# EAGLE schematic Aux Power Board V1.1 (EAGLE 9.2.2)

## Sheet 1 of 3
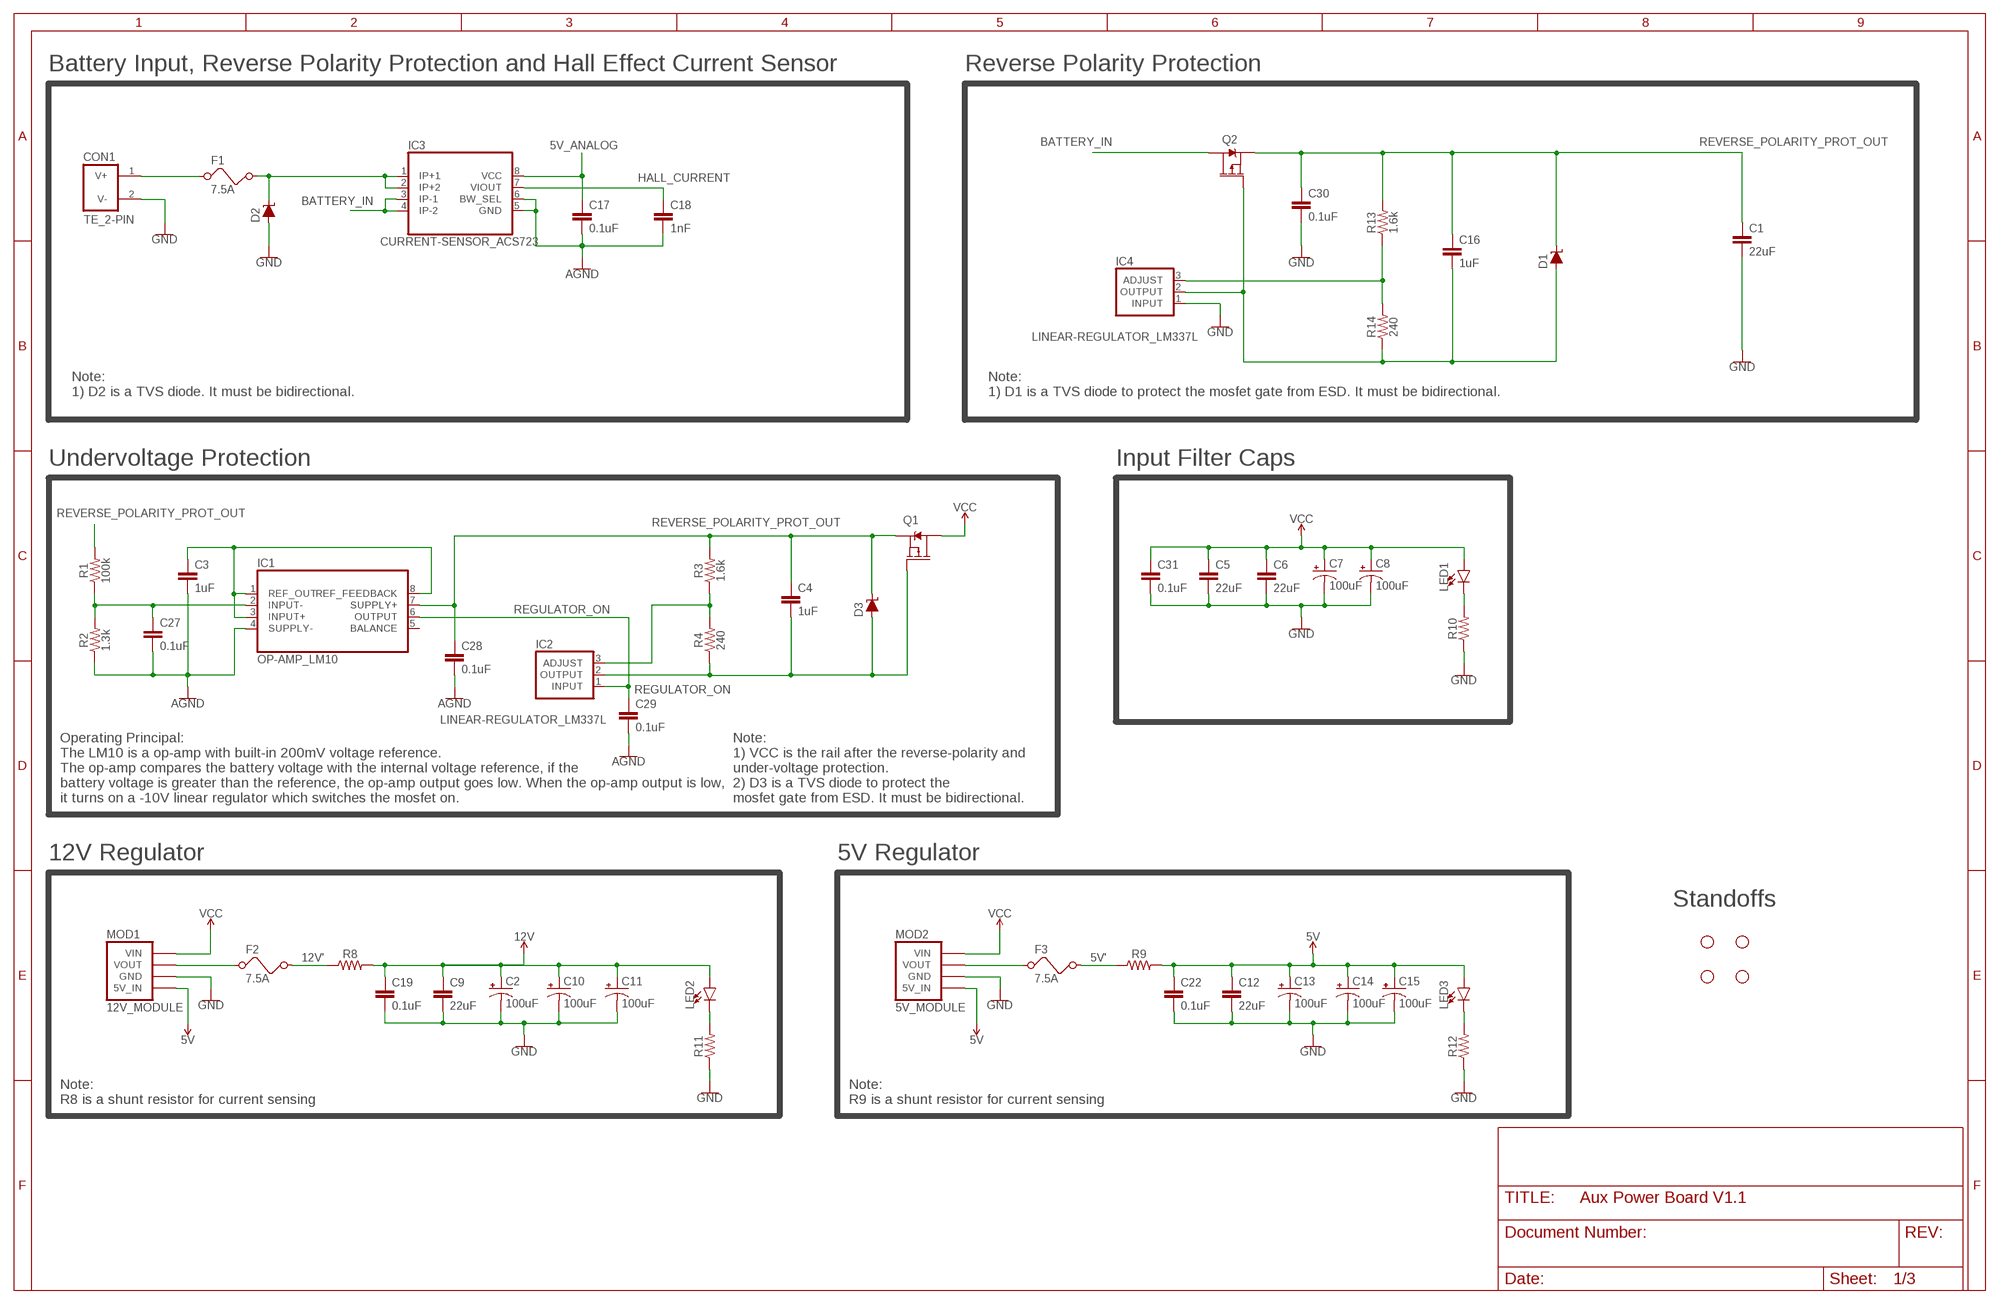
[diagram p0: schematic, sheet 1]

### Parts
C1  22uF  CAPACITOR_1210  [1210]
C2  100uF  CAPACITOR_ELECTROLYTIC_100UF  [CAPACITOR_100UF_50V]
C3  1uF  CAPACITOR_0805  [0805]
C4  1uF  CAPACITOR_0805  [0805]
C5  22uF  CAPACITOR_1210  [1210]
C6  22uF  CAPACITOR_1210  [1210]
C7  100uF  CAPACITOR_ELECTROLYTIC_100UF  [CAPACITOR_100UF_50V]
C8  100uF  CAPACITOR_ELECTROLYTIC_100UF  [CAPACITOR_100UF_50V]
C9  22uF  CAPACITOR_0805  [0805]
C10  100uF  CAPACITOR_ELECTROLYTIC_100UF  [CAPACITOR_100UF_50V]
C11  100uF  CAPACITOR_ELECTROLYTIC_100UF  [CAPACITOR_100UF_50V]
C12  22uF  CAPACITOR_0805  [0805]
C13  100uF  CAPACITOR_ELECTROLYTIC_100UF  [CAPACITOR_100UF_50V]
C14  100uF  CAPACITOR_ELECTROLYTIC_100UF  [CAPACITOR_100UF_50V]
C15  100uF  CAPACITOR_ELECTROLYTIC_100UF  [CAPACITOR_100UF_50V]
C16  1uF  CAPACITOR_0805  [0805]
C17  0.1uF  CAPACITOR_0805  [0805]
C18  1nF  CAPACITOR_0805  [0805]
C19  0.1uF  CAPACITOR_0805  [0805]
C22  0.1uF  CAPACITOR_0805  [0805]
C27  0.1uF  CAPACITOR_0805  [0805]
C28  0.1uF  CAPACITOR_0805  [0805]
C29  0.1uF  CAPACITOR_0805  [0805]
C30  0.1uF  CAPACITOR_0805  [0805]
C31  0.1uF  CAPACITOR_0805  [0805]
CON1  TE_2-PIN  [TE_2-PIN]
D1  DIODE_TVS_DO-214AA  [DO214AA]
D2  DIODE_TVS_DO-214AA  [DO214AA]
D3  DIODE_TVS_DO-214AA  [DO214AA]
F1  7.5A  FUSEHOLDER_VERTICAL  [FUSEHOLDER_VERTICAL]
F2  7.5A  FUSEHOLDER_VERTICAL  [FUSEHOLDER_VERTICAL]
F3  7.5A  FUSEHOLDER_VERTICAL  [FUSEHOLDER_VERTICAL]
H1  STAND-OFF  [STAND-OFF]
H2  STAND-OFF  [STAND-OFF]
H3  STAND-OFF  [STAND-OFF]
H4  STAND-OFF  [STAND-OFF]
IC1  OP-AMP_LM10  [DIP08]
IC2  LINEAR-REGULATOR_LM337L  [TO92]
IC3  CURRENT-SENSOR_ACS723  [SOIC8]
IC4  LINEAR-REGULATOR_LM337L  [TO92]
LED1  LED_0805  [0805_LED]
LED2  LED_0805  [0805_LED]
LED3  LED_0805  [0805_LED]
MOD1  12V_MODULE  [5/12V_MODULE]
MOD2  5V_MODULE  [5/12V_MODULE]
Q1  MOSFET_PMOS_TO-263  [TO-263/D2PAK]
Q2  MOSFET_PMOS_TO-263  [TO-263/D2PAK]
R1  100k  RESISTOR_0805  [0805]
R2  1.3k  RESISTOR_0805  [0805]
R3  1.6k  RESISTOR_0805  [0805]
R4  240  RESISTOR_0805  [0805]
R8  RESISTOR_1210  [1210]
R9  RESISTOR_1210  [1210]
R10  RESISTOR_0805  [0805]
R11  RESISTOR_0805  [0805]
R12  RESISTOR_0805  [0805]
R13  1.6k  RESISTOR_0805  [0805]
R14  240  RESISTOR_0805  [0805]

### Nets
5V: C12.1 C13.+ C14.+ C15.+ C22.1 LED3.1(A) MOD1.P$32(5V_IN) MOD2.P$32(5V_IN) R9.2 ; also sheet 2,3
5V': F3.3 F3.4 R9.1 ; also sheet 3
5V_ANALOG: C17.1 IC3.8(VCC) ; also sheet 3
12V: C2.+ C9.1 C10.+ C11.+ C19.1 LED2.1(A) R8.2 ; also sheet 2,3
12V': F2.3 F2.4 R8.1 ; also sheet 3
AGND: C3.2 C17.2 C18.2 C27.2 C28.2 C29.2 IC1.4(SUPPLY-) IC3.5(GND) IC3.6(BW_SEL) R2.1 ; also sheet 3
BATTERY_IN: IC3.3(IP-1) IC3.4(IP-2) Q2.2(D) ; also sheet 3
GND: C1.2 C2.- C5.2 C6.2 C7.- C8.- C9.2 C10.- C11.- C12.2 C13.- C14.- C15.- C19.2 C22.2 C30.2 C31.2 CON1.2(V-) D2.A IC4.1(INPUT) MOD1.P$25(GND) MOD1.P$26(GND) MOD1.P$27(GND) MOD1.P$28(GND) MOD1.P$29(GND) MOD1.P$30(GND) MOD1.P$31(GND) MOD2.P$25(GND) MOD2.P$26(GND) MOD2.P$27(GND) MOD2.P$28(GND) MOD2.P$29(GND) MOD2.P$30(GND) MOD2.P$31(GND) R10.1 R11.1 R12.1 ; also sheet 2,3
HALL_CURRENT: C18.1 IC3.7(VIOUT) ; also sheet 3
N$2: CON1.1(V+) F1.1 F1.2
N$4: LED1.2(C) R10.2
N$5: C3.1 IC1.1(REF_OUT) IC1.3(INPUT+) IC1.8(REF_FEEDBACK)
N$6: C27.1 IC1.2(INPUT-) R1.1 R2.2
N$7: F2.1 F2.2 MOD1.P$9(VOUT) MOD1.P$10(VOUT) MOD1.P$11(VOUT) MOD1.P$12(VOUT) MOD1.P$13(VOUT) MOD1.P$14(VOUT) MOD1.P$15(VOUT) MOD1.P$16(VOUT) MOD1.P$17(VOUT) MOD1.P$18(VOUT) MOD1.P$19(VOUT) MOD1.P$20(VOUT) MOD1.P$21(VOUT) MOD1.P$22(VOUT) MOD1.P$23(VOUT) MOD1.P$24(VOUT)
N$8: C4.2 D3.A IC2.2(OUTPUT) Q1.1(G) R4.1
N$9: IC2.3(ADJUST) R3.1 R4.2
N$11: F3.1 F3.2 MOD2.P$9(VOUT) MOD2.P$10(VOUT) MOD2.P$11(VOUT) MOD2.P$12(VOUT) MOD2.P$13(VOUT) MOD2.P$14(VOUT) MOD2.P$15(VOUT) MOD2.P$16(VOUT) MOD2.P$17(VOUT) MOD2.P$18(VOUT) MOD2.P$19(VOUT) MOD2.P$20(VOUT) MOD2.P$21(VOUT) MOD2.P$22(VOUT) MOD2.P$23(VOUT) MOD2.P$24(VOUT)
N$13: LED3.2(C) R12.2
N$17: LED2.2(C) R11.2
N$18: IC4.3(ADJUST) R13.1 R14.2
N$21: C16.2 D1.A IC4.2(OUTPUT) Q2.1(G) R14.1
N$22: D2.C F1.3 F1.4 IC3.1(IP+1) IC3.2(IP+2)
REGULATOR_ON: C29.1 IC1.6(OUTPUT) IC2.1(INPUT)
REVERSE_POLARITY_PROT_OUT: C1.1 C4.1 C16.1 C28.1 C30.1 D1.C D3.C IC1.7(SUPPLY+) Q1.3(S) Q2.3(S) R1.2 R3.2 R13.2
VCC: C5.1 C6.1 C7.+ C8.+ C31.1 LED1.1(A) MOD1.P$1(VIN) MOD1.P$2(VIN) MOD1.P$3(VIN) MOD1.P$4(VIN) MOD1.P$5(VIN) MOD1.P$6(VIN) MOD1.P$7(VIN) MOD1.P$8(VIN) MOD2.P$1(VIN) MOD2.P$2(VIN) MOD2.P$3(VIN) MOD2.P$4(VIN) MOD2.P$5(VIN) MOD2.P$6(VIN) MOD2.P$7(VIN) MOD2.P$8(VIN) Q1.2(D) ; also sheet 3
Unconnected: IC1.5(BALANCE)

### Notes on the sheet
- Battery Input, Reverse Polarity Protection and Hall Effect Current Sensor | Reverse Polarity Protection
- Note: 
  1) D2 is a TVS diode. It must be bidirectional.
- Note: 
  1) D1 is a TVS diode to protect the mosfet gate from ESD. It must be bidirectional.
- Undervoltage Protection | Input Filter Caps
- Operating Principal: 
  The LM10 is a op-amp with built-in 200mV voltage reference.
  The op-amp compares the battery voltage with the internal voltage reference, if the 
  battery voltage is greater than the reference, the op-amp output goes low. When the op-amp output is low, 
  it turns on a -10V linear regulator which switches the mosfet on.
- Note: 
  1) VCC is the rail after the reverse-polarity and
  under-voltage protection.
  2) D3 is a TVS diode to protect the
  mosfet gate from ESD. It must be bidirectional.
- 12V Regulator | 5V Regulator
- Standoffs
- Note: 
  R8 is a shunt resistor for current sensing
- Note: 
  R9 is a shunt resistor for current sensing

## Sheet 2 of 3
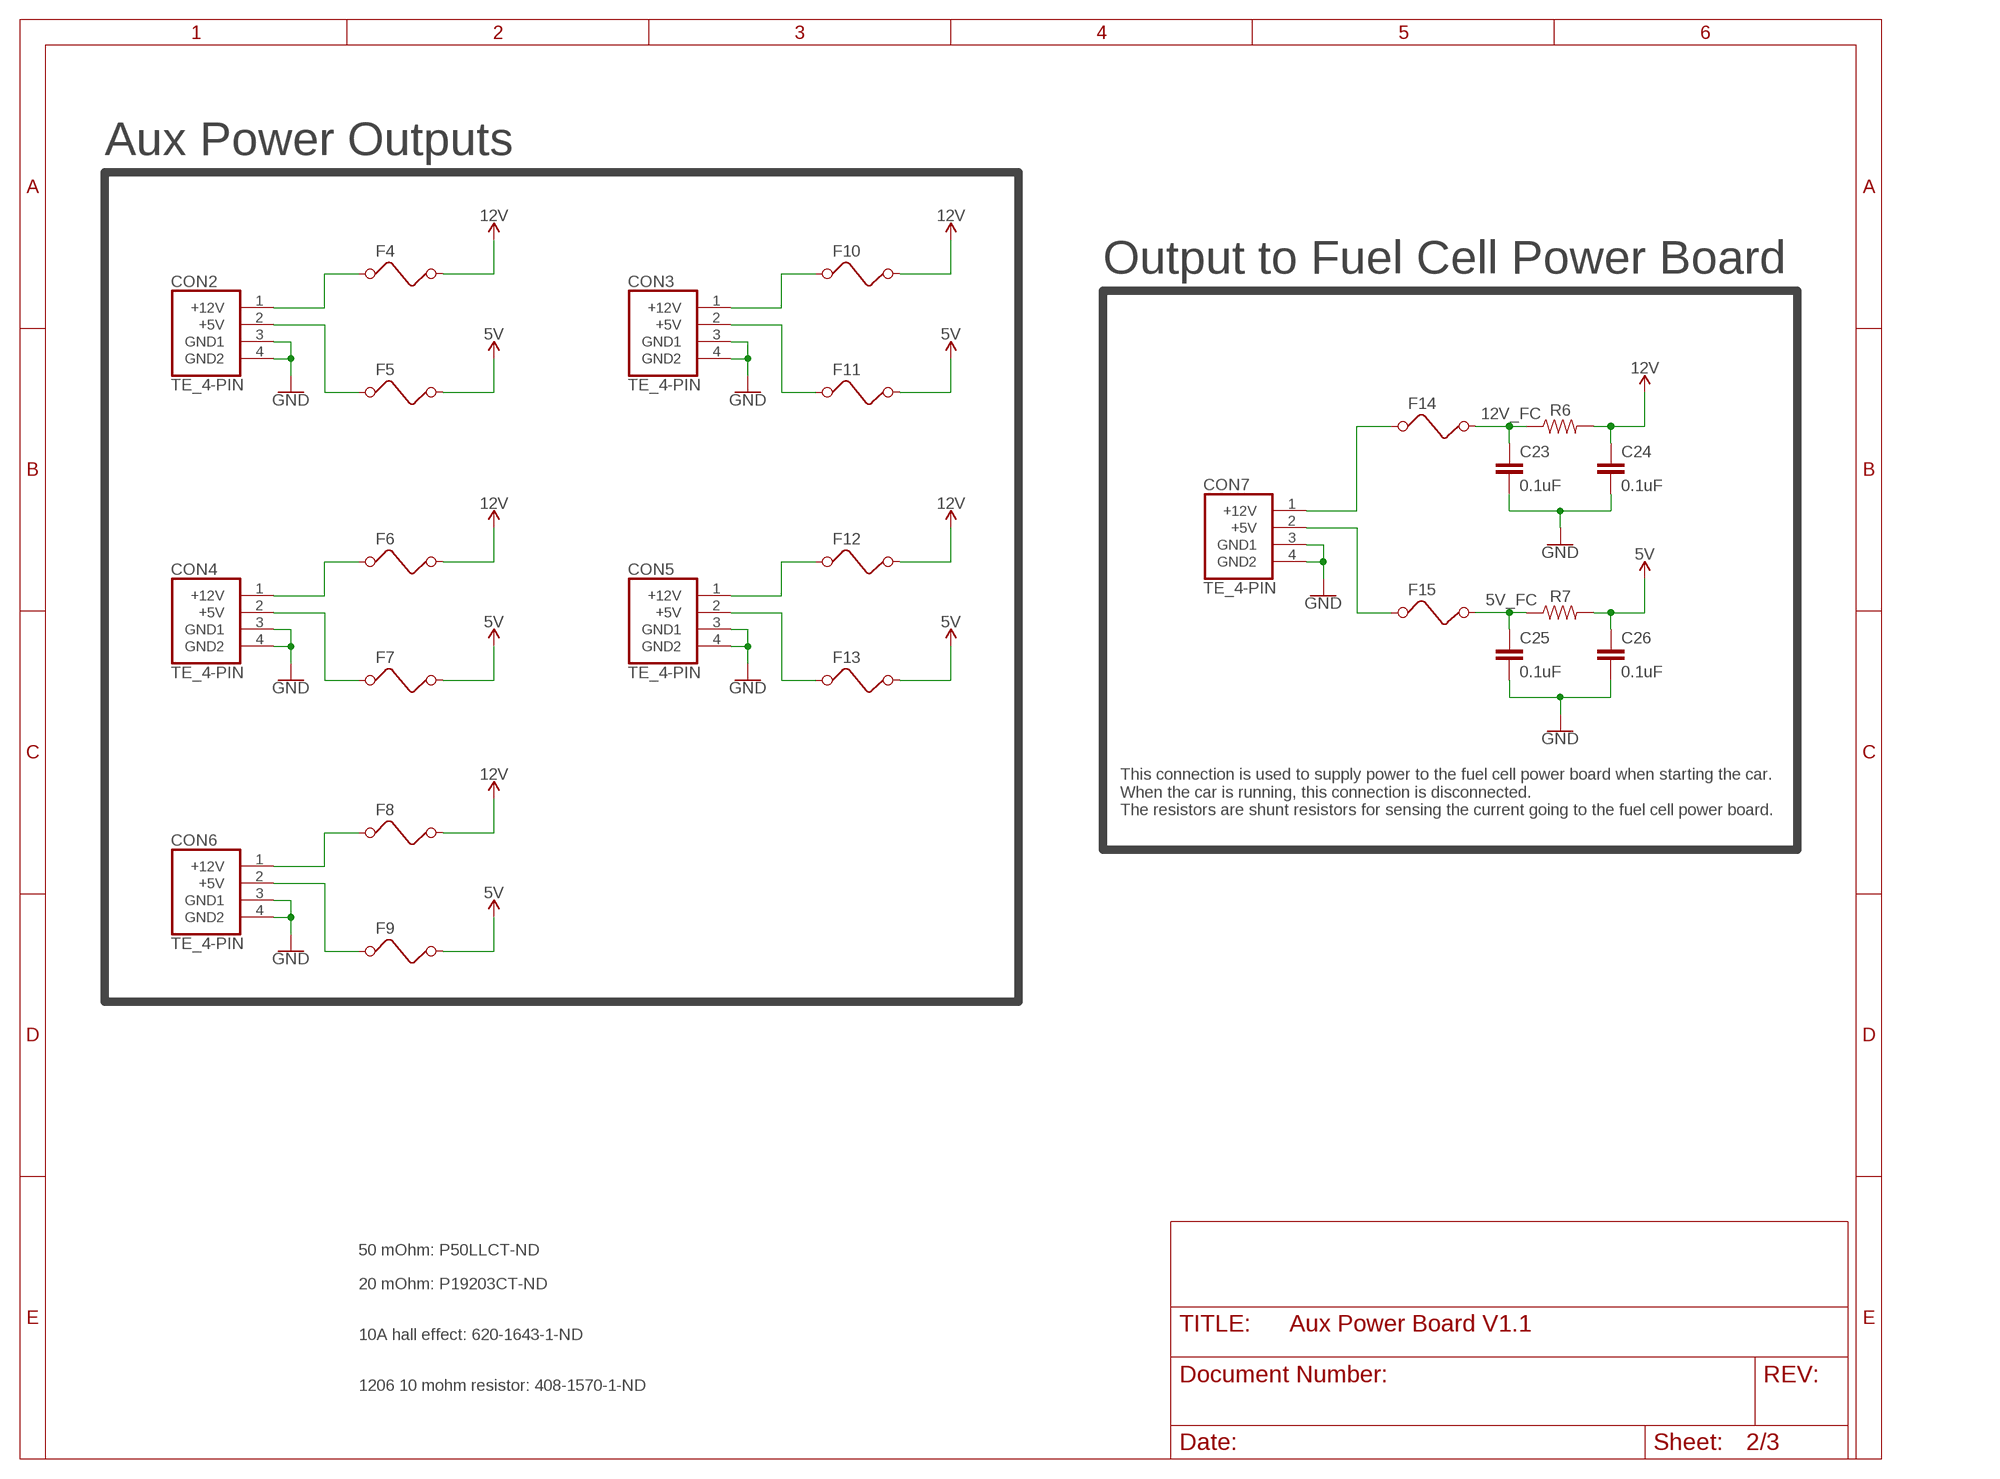
[diagram p1: schematic, sheet 2]

### Parts
C23  0.1uF  CAPACITOR_0805  [0805]
C24  0.1uF  CAPACITOR_0805  [0805]
C25  0.1uF  CAPACITOR_0805  [0805]
C26  0.1uF  CAPACITOR_0805  [0805]
CON2  TE_4-PIN  [TE_4-PIN]
CON3  TE_4-PIN  [TE_4-PIN]
CON4  TE_4-PIN  [TE_4-PIN]
CON5  TE_4-PIN  [TE_4-PIN]
CON6  TE_4-PIN  [TE_4-PIN]
CON7  TE_4-PIN  [TE_4-PIN]
F4  FUSE_1210  [1210]
F5  FUSE_1210  [1210]
F6  FUSE_1210  [1210]
F7  FUSE_1210  [1210]
F8  FUSE_1210  [1210]
F9  FUSE_1210  [1210]
F10  FUSE_1210  [1210]
F11  FUSE_1210  [1210]
F12  FUSE_1210  [1210]
F13  FUSE_1210  [1210]
F14  FUSE_1210  [1210]
F15  FUSE_1210  [1210]
R6  RESISTOR_1210  [1210]
R7  RESISTOR_1210  [1210]

### Nets
5V: C26.1 F5.2 F7.2 F9.2 F11.2 F13.2 R7.2 ; also sheet 1,3
5V_FC: C25.1 F15.2 R7.1 ; also sheet 3
12V: C24.1 F4.2 F6.2 F8.2 F10.2 F12.2 R6.2 ; also sheet 1,3
12V_FC: C23.1 F14.2 R6.1 ; also sheet 3
GND: C23.2 C24.2 C25.2 C26.2 CON2.3(GND1) CON2.4(GND2) CON3.3(GND1) CON3.4(GND2) CON4.3(GND1) CON4.4(GND2) CON5.3(GND1) CON5.4(GND2) CON6.3(GND1) CON6.4(GND2) CON7.3(GND1) CON7.4(GND2) ; also sheet 1,3
N$1: CON2.1(+12V) F4.1
N$10: CON2.2(+5V) F5.1
N$15: CON3.2(+5V) F11.1
N$16: CON3.1(+12V) F10.1
N$19: CON5.2(+5V) F13.1
N$20: CON5.1(+12V) F12.1
N$23: CON4.2(+5V) F7.1
N$24: CON4.1(+12V) F6.1
N$27: CON6.2(+5V) F9.1
N$28: CON6.1(+12V) F8.1
N$31: CON7.2(+5V) F15.1
N$32: CON7.1(+12V) F14.1

### Notes on the sheet
- Aux Power Outputs
- Output to Fuel Cell Power Board
- This connection is used to supply power to the fuel cell power board when starting the car. 
  When the car is running, this connection is disconnected.
  The resistors are shunt resistors for sensing the current going to the fuel cell power board.
- 50 mOhm: P50LLCT-ND
- 20 mOhm: P19203CT-ND
- 10A hall effect: 620-1643-1-ND
- 1206 10 mohm resistor: 408-1570-1-ND

## Sheet 3 of 3
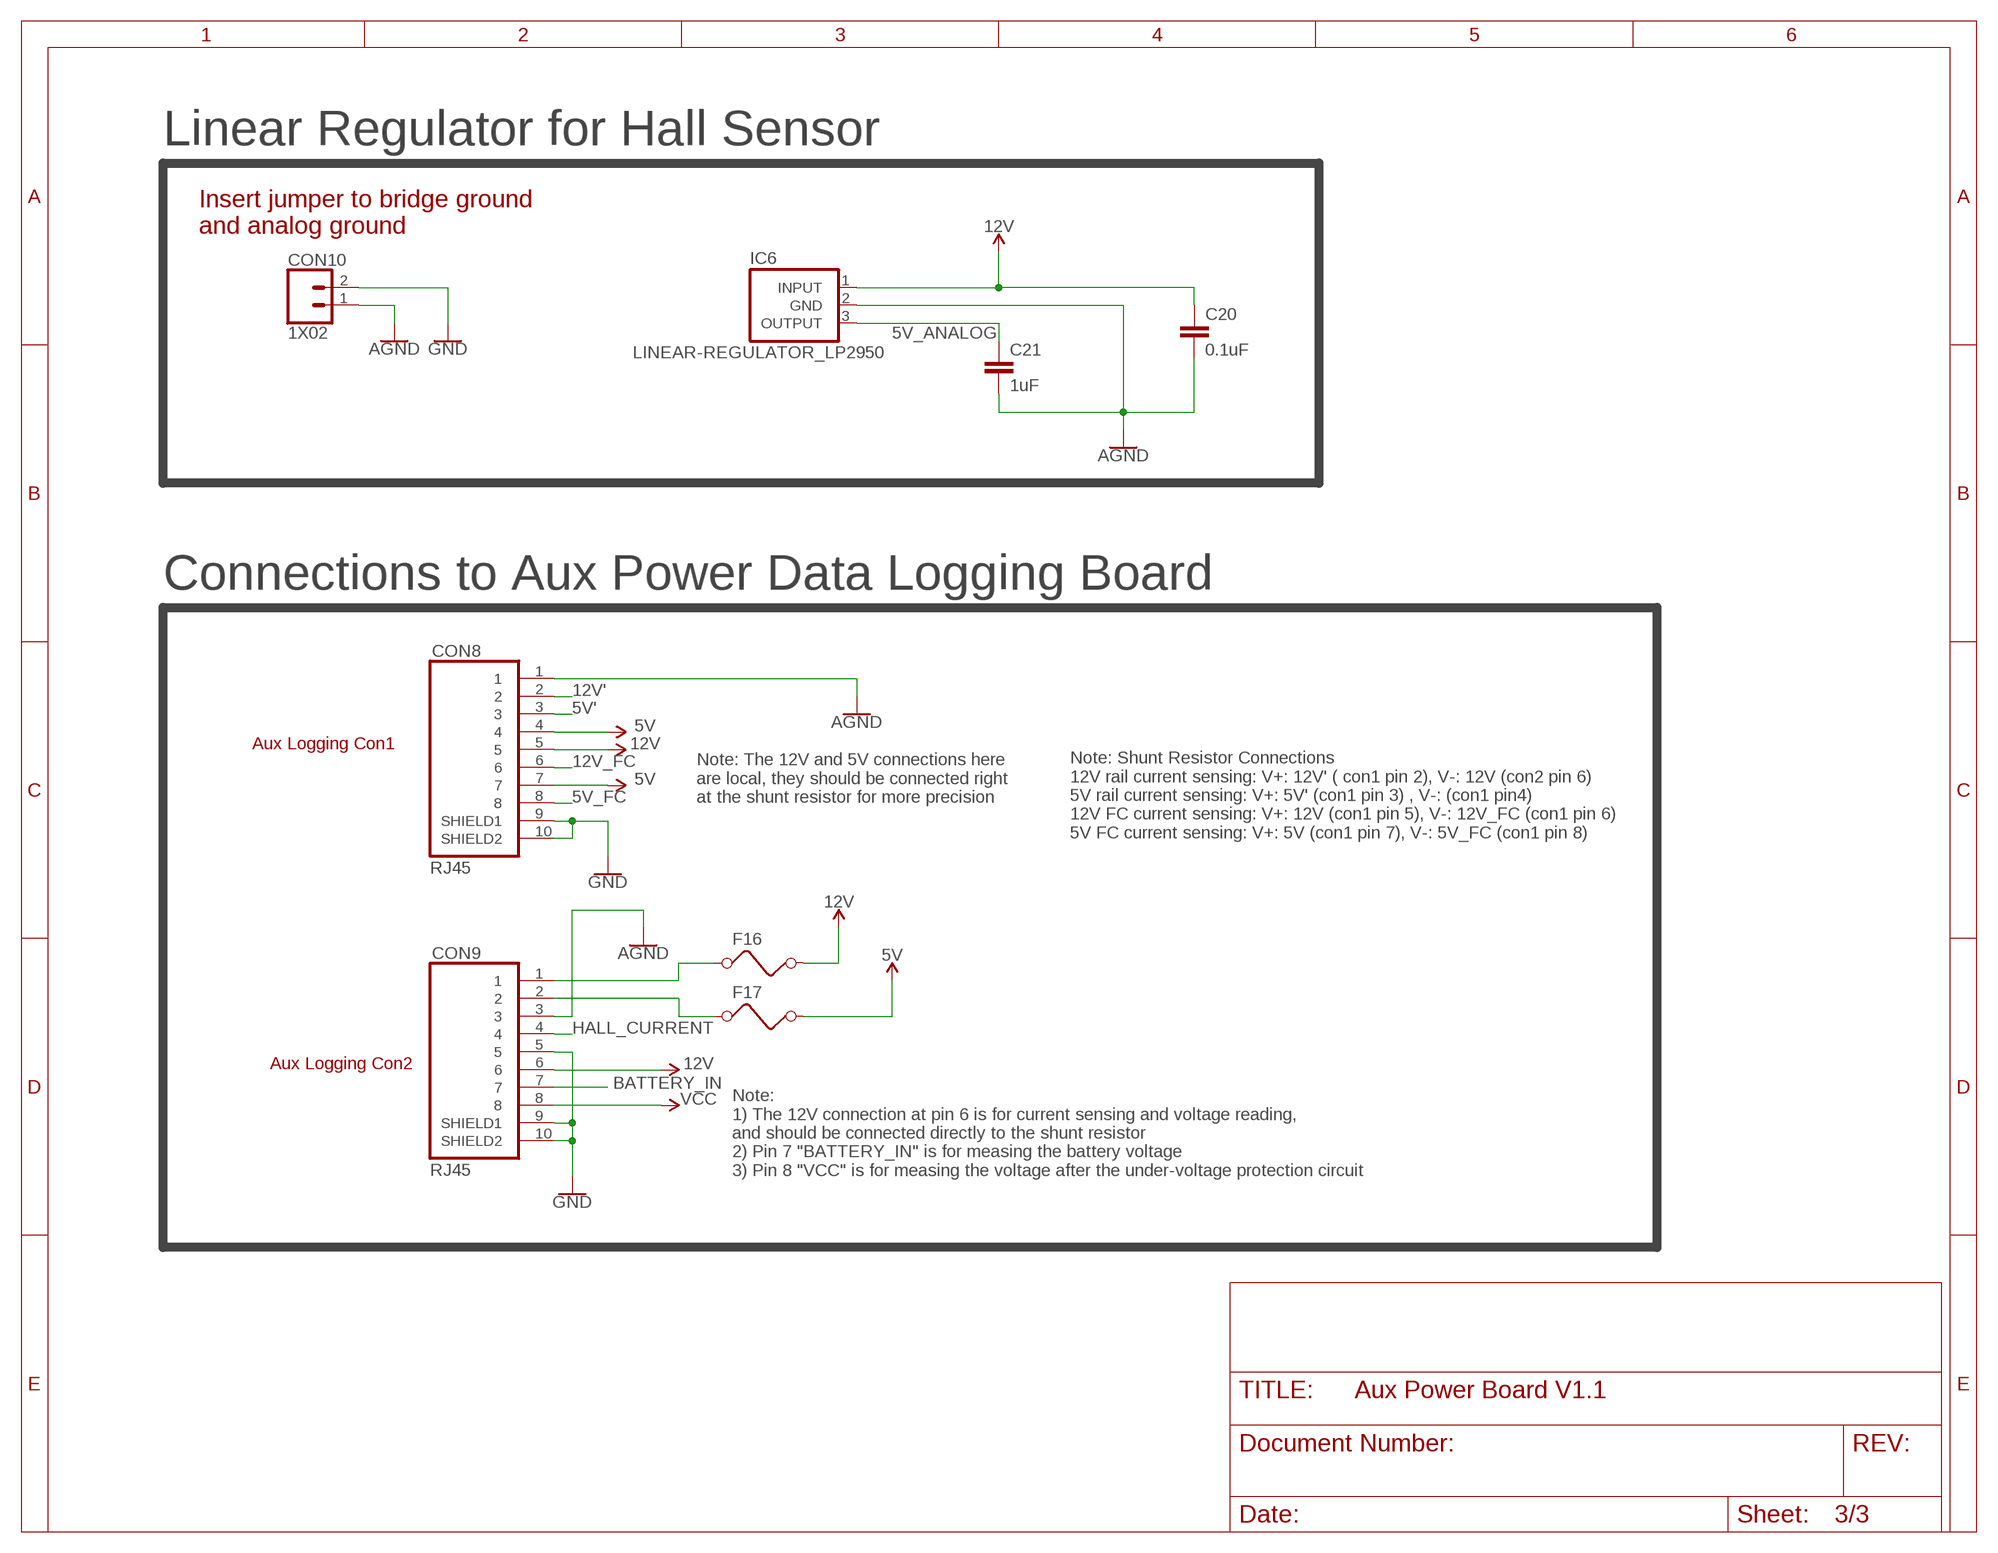
[diagram p2: schematic, sheet 3]

### Parts
C20  0.1uF  CAPACITOR_0805  [0805]
C21  1uF  CAPACITOR_0805  [0805]
CON8  RJ45  [RJ45]
CON9  RJ45  [RJ45]
CON10  1X02  [1X02]
F16  FUSE_1210  [1210]
F17  FUSE_1210  [1210]
IC6  LINEAR-REGULATOR_LP2950  [TO92]

### Nets
5V: CON8.4 CON8.7 F17.2 ; also sheet 1,2
5V': CON8.3 ; also sheet 1
5V_ANALOG: C21.1 IC6.3(OUTPUT) ; also sheet 1
5V_FC: CON8.8 ; also sheet 2
12V: C20.1 CON8.5 CON9.6 F16.2 IC6.1(INPUT) ; also sheet 1,2
12V': CON8.2 ; also sheet 1
12V_FC: CON8.6 ; also sheet 2
AGND: C20.2 C21.2 CON8.1 CON9.3 CON10.1 IC6.2(GND) ; also sheet 1
BATTERY_IN: CON9.7 ; also sheet 1
GND: CON8.9(SHIELD1) CON8.10(SHIELD2) CON9.5 CON9.9(SHIELD1) CON9.10(SHIELD2) CON10.2 ; also sheet 1,2
HALL_CURRENT: CON9.4 ; also sheet 1
N$12: CON9.1 F16.1
N$14: CON9.2 F17.1
VCC: CON9.8 ; also sheet 1

### Notes on the sheet
- Linear Regulator for Hall Sensor
- Insert jumper to bridge ground
  and analog ground
- Connections to Aux Power Data Logging Board
- Aux Logging Con1
- Note: The 12V and 5V connections here
  are local, they should be connected right
  at the shunt resistor for more precision
- Note: Shunt Resistor Connections
  12V rail current sensing: V+: 12V' ( con1 pin 2), V-: 12V (con2 pin 6)
  5V rail current sensing: V+: 5V' (con1 pin 3) , V-: (con1 pin4)
  12V FC current sensing: V+: 12V (con1 pin 5), V-: 12V_FC (con1 pin 6)
  5V FC current sensing: V+: 5V (con1 pin 7), V-: 5V_FC (con1 pin 8)
- Aux Logging Con2
- Note: 
  1) The 12V connection at pin 6 is for current sensing and voltage reading, 
  and should be connected directly to the shunt resistor
  2) Pin 7 "BATTERY_IN" is for measing the battery voltage
  3) Pin 8 "VCC" is for measing the voltage after the under-voltage protection circuit

## Library data of the parts
C1 C5 C6 = EcoCar-Passives:CAPACITOR_1210
C2 C7 C8 C10 C11 C13-C15 = EcoCar-Passives:CAPACITOR_ELECTROLYTIC_100UF: 50V 100uF Electrolytic Capacitor Manufacturer: Nichicon Series: UVZ Part Number: UVZ1H101MPD1TD Digikey Part Number: 493-13464-1-ND
C3 C4 C9 C12 C16-C31 = EcoCar-Passives:CAPACITOR_0805
CON1 = EcoCar-Connectors:TE_2-PIN: 2 Pin TE Mini-Universal MATE-N-LOK - Use for signals and power connections Part Number: 1-770966-0 Digikey Part Number: A32471-ND Matching Plug: A25587-ND Matching Crimps: A100828CT-ND
CON2-CON7 = EcoCar-Connectors:TE_4-PIN: 4 Pin TE Mini-Universal MATE-N-LOK - Use for 12V and 5V connections Part Number: 1-770968-0 Digikey Part Number: A32474-ND Matching Plug: A25571-ND Matching Crimps: A100828CT-ND
CON8 CON9 = EcoCar-Connectors:RJ45: RJ45 Connector - Use for signals and low power connections Unshielded Part Number: RJHSE-5080 Unshielded Digikey Part Number: RJHSE-5080-ND Shielded Part Number: RJHSE5E80 Shielded Digikey Part Number: RJHSE5E80-ND
CON10 = EcoCar-Connectors-2.54mm:1X02: 2.54mm (0.1") Header
D1-D3 = EcoCar-Fuses-Protection:DIODE_TVS_DO-214AA
F1-F3 = EcoCar-Fuses-Protection:FUSEHOLDER_VERTICAL: Vertical Fuse Holder for Mini Blade Fuses Manufacturer: Keystone Part Number: 3568 Digikey Part Number: 36-3568-ND
F4-F17 = EcoCar-Fuses-Protection:FUSE_1210: 1210 Surface Mount Fuse
H1-H4 = EcoCar-Miscellaneous:STAND-OFF: Stand Off Drill holes for mechanically mounting via screws, standoffs, etc. Note: Use the keepout ring to avoid running the screw head into surrounding components. Variant Overviews STAND-OFF - Mechanical footprint for a #4 phillips button head screw. STAND-OFF-TIGHT - Mechanical footprint for a #4 phillips button head screw, Example SparkFun Products Screw - Phillips Head (1/4", 4-40, 10 pack) <https://www.sparkfun.com/products/10453> (PRT-10453) Screw - Phillips Head (1/2", 4-40, 10 pack) <https://www.sparkfun.com/products/10452> (PRT-10452) Screw - Phillips Head (3/4", 4-40, 10 pack) <https://www.sparkfun.com/products/10451> (PRT-10451) Screw - Phillips Head (1", 4-40, 10 pack) <https://www.sparkfun.com/products/10450> (PRT-10450)
IC1 = EcoCar-Integrated-Circuits:OP-AMP_LM10: Op-Amp with Internal Voltage Reference Manufacturer: Texas Instruments Part Number: LM10CN/NOPB Digikey Part Number: LM10CN/NOPB-ND
IC2 IC4 = EcoCar-Integrated-Circuits:LINEAR-REGULATOR_LM337L: Adjustable Negative Linear Voltage Regulator Manufacturer: Texas Instruments Part Number: LM337LZ/NOPB Digikey Part Number: LM337LZ/NOPB-ND
IC3 = EcoCar-Integrated-Circuits:CURRENT-SENSOR_ACS723: 10A Hall Effect Current Sensor Manufacturer: Allegro MicroSystems Part Number: ACS723LLCTR-10AU-T Digikey Part Number: 620-1643-1-ND Note: pinout fixed Nov 28, 2019
IC6 = EcoCar-Integrated-Circuits:LINEAR-REGULATOR_LP2950: 5V Linear Regulator Manufacturer: Texas Instruments Part Number: LP2950-50LPRE3 Digikey Part Number: 296-20933-1-ND
LED1-LED3 = EcoCar-Discrete-Semiconductors:LED_0805
MOD1 = EcoCar-Modules:12V_MODULE: 12V Regulator Module Notes: 1) if duty cycle > 65%, connect external 5V source to improve efficiency 2) the 12V and 5V regulator modules use the same PCB. Make sure to solder the proper header for 12V or 5V. Use the correct resistor ratio for 12V or 5V.
MOD2 = EcoCar-Modules:5V_MODULE: 5V Regulator Module Notes: 1) if duty cycle > 65%, connect external 5V source to improve efficiency 2) the 12V and 5V regulator modules use the same PCB. Make sure to solder the proper header for 12V or 5V. Use the correct resistor ratio for 12V or 5V.
Q1 Q2 = EcoCar-Discrete-Semiconductors:MOSFET_PMOS_TO-263
R1-R4 R10-R14 = EcoCar-Passives:RESISTOR_0805
R6-R9 = EcoCar-Passives:RESISTOR_1210